# EAGLE design SmartON (EAGLE 9.4.2)
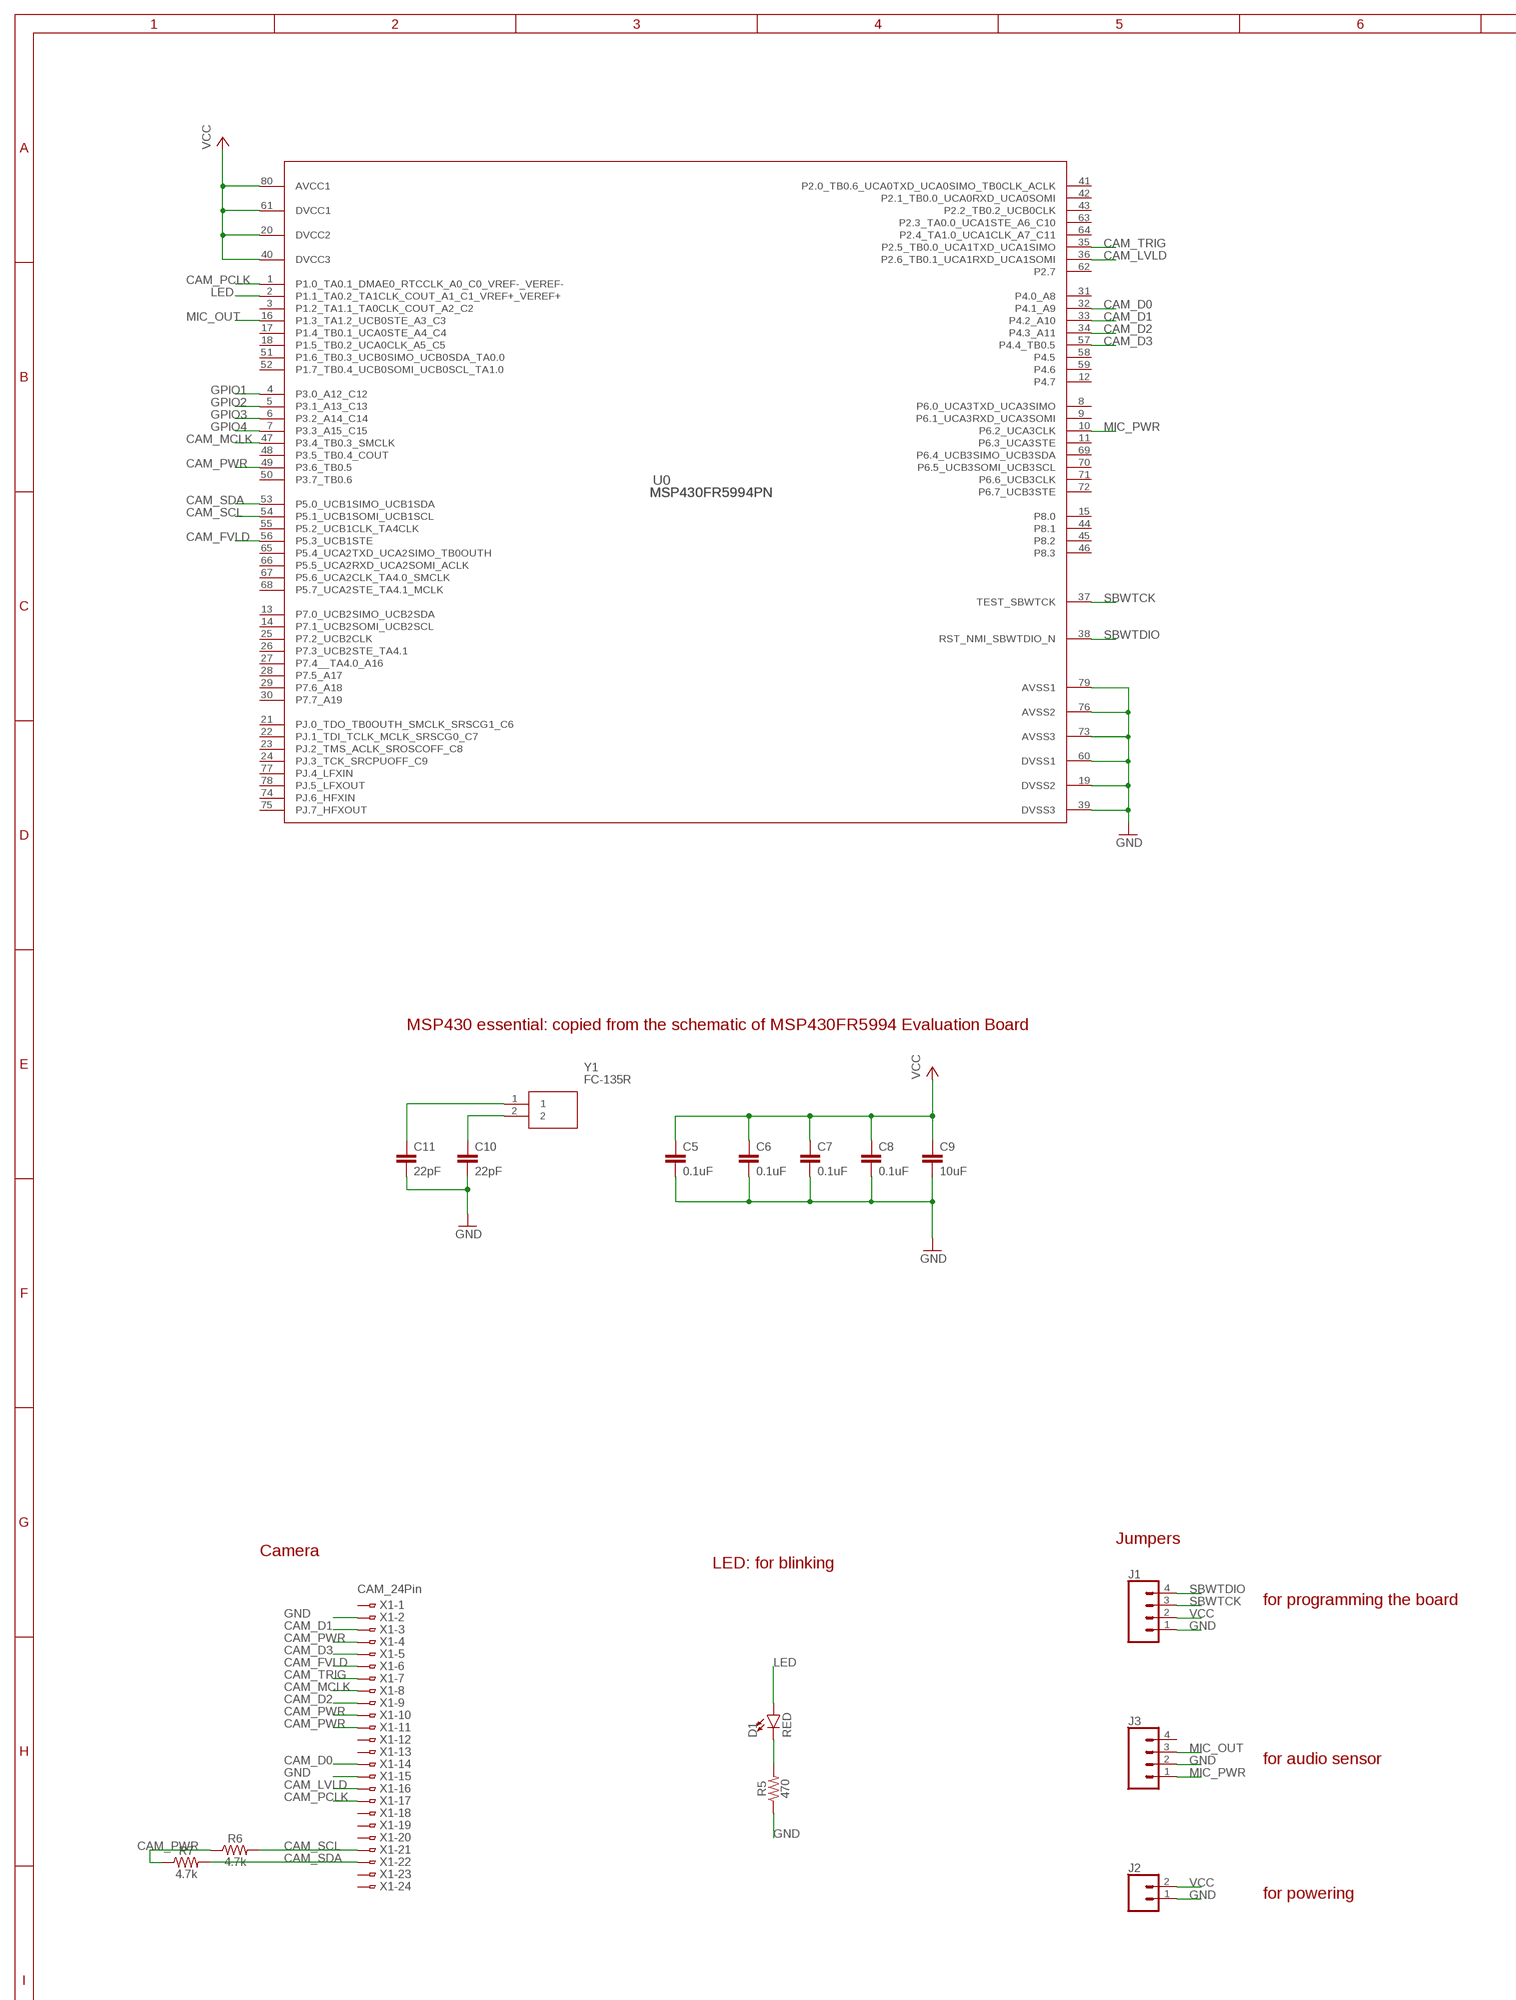
[diagram p0: schematic, sheet 1, part 1 of 2]
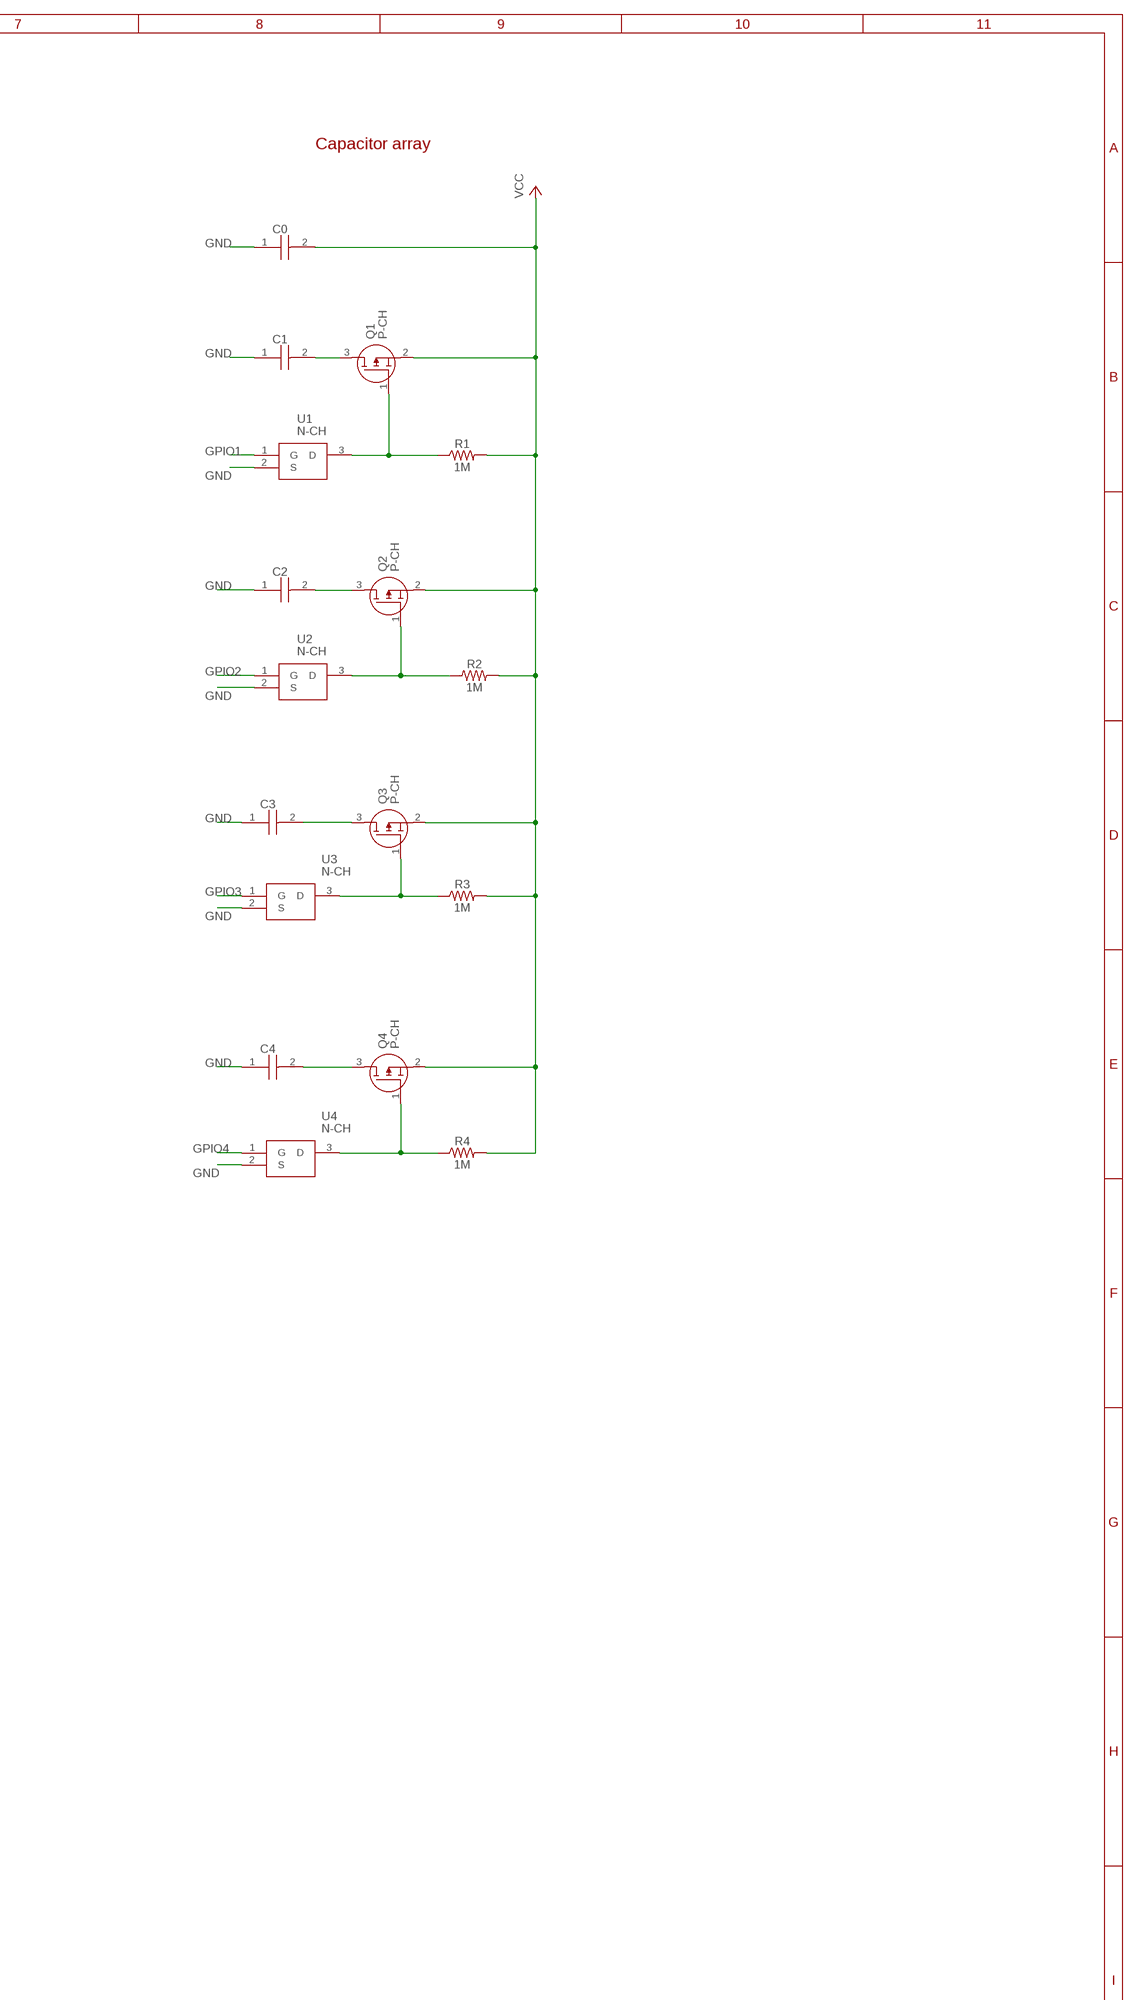
[diagram p1: schematic, sheet 1, part 2 of 2]

## Parts
C0  DBN-5R5D224T  [CAPPRD500W130D1350H800]
C1  DBN-5R5D224T  [CAPPRD500W130D1350H800]
C2  DBN-5R5D224T  [CAPPRD500W130D1350H800]
C3  DBN-5R5D224T  [CAPPRD500W130D1350H800]
C4  DBN-5R5D224T  [CAPPRD500W130D1350H800]
C5  0.1uF  0.1UF-0603-25V-5%  [0603]
C6  0.1uF  0.1UF-0603-25V-5%  [0603]
C7  0.1uF  0.1UF-0603-25V-5%  [0603]
C8  0.1uF  0.1UF-0603-25V-5%  [0603]
C9  10uF  10UF-0603-6.3V-20%  [0603]
C10  22pF  22PF-0603-50V-5%  [0603]
C11  22pF  22PF-0603-50V-5%  [0603]
D1  RED  LED-RED0603  [LED-0603]
J1  CONN_04LOCK  [1X04_LOCK]
J2  CONN_02  [1X02]
J3  CONN_04LOCK  [1X04_LOCK]
Q1  P-CH  IRLML5103PBF  [SOT95P237X112-3N]
Q2  P-CH  IRLML5103PBF  [SOT95P237X112-3N]
Q3  P-CH  IRLML5103PBF  [SOT95P237X112-3N]
Q4  P-CH  IRLML5103PBF  [SOT95P237X112-3N]
R1  1M  1MOHM-0603-1/4W-5%  [0603]
R2  1M  1MOHM-0603-1/4W-5%  [0603]
R3  1M  1MOHM-0603-1/4W-5%  [0603]
R4  1M  1MOHM-0603-1/4W-5%  [0603]
R5  470  470OHM-0603-1/10W-1%  [0603]
R6  4.7k  4.7KOHM-0603-1/10W-1%  [0603]
R7  4.7k  4.7KOHM-0603-1/10W-1%  [0603]
U0  MSP430FR5994PN  MSP430FR5994IPN  [PN0080A_N]
U1  N-CH  DMN2004K-7  [SOT95P240X110-3N]
U2  N-CH  DMN2004K-7  [SOT95P240X110-3N]
U3  N-CH  DMN2004K-7  [SOT95P240X110-3N]
U4  N-CH  DMN2004K-7  [SOT95P240X110-3N]
X1  CAM_24Pin  FH12-24S-0.5SH  [FH12-24S-0.5SH]
Y1  FC-135R  [FC135327680KAAG0]

## Nets
CAM_D0: U0.32(P4.1_A9) X1.14
CAM_D1: U0.33(P4.2_A10) X1.3
CAM_D2: U0.34(P4.3_A11) X1.9
CAM_D3: U0.57(P4.4_TB0.5) X1.5
CAM_FVLD: U0.56(P5.3_UCB1STE) X1.6
CAM_LVLD: U0.36(P2.6_TB0.1_UCA1RXD_UCA1SOMI) X1.16
CAM_MCLK: U0.47(P3.4_TB0.3_SMCLK) X1.8
CAM_PCLK: U0.1(P1.0_TA0.1_DMAE0_RTCCLK_A0_C0_VREF-_VEREF-) X1.17
CAM_PWR: R6.1 R7.1 U0.49(P3.6_TB0.5) X1.4 X1.10 X1.11
CAM_SCL: R6.2 U0.54(P5.1_UCB1SOMI_UCB1SCL) X1.21
CAM_SDA: R7.2 U0.53(P5.0_UCB1SIMO_UCB1SDA) X1.22
CAM_TRIG: U0.35(P2.5_TB0.0_UCA1TXD_UCA1SIMO) X1.7
GND: C0.1(+) C1.1(+) C2.1(+) C3.1(+) C4.1(+) C5.2 C6.2 C7.2 C8.2 C9.2 C10.2 C11.2 J1.1 J2.1 J3.2 R5.1 U0.19(DVSS2) U0.39(DVSS3) U0.60(DVSS1) U0.73(AVSS3) U0.76(AVSS2) U0.79(AVSS1) U1.2(S) U2.2(S) U3.2(S) U4.2(S) X1.2 X1.15
GPIO1: U0.4(P3.0_A12_C12) U1.1(G)
GPIO2: U0.5(P3.1_A13_C13) U2.1(G)
GPIO3: U0.6(P3.2_A14_C14) U3.1(G)
GPIO4: U0.7(P3.3_A15_C15) U4.1(G)
LED: D1.A U0.2(P1.1_TA0.2_TA1CLK_COUT_A1_C1_VREF+_VEREF+)
MIC_OUT: J3.3 U0.16(P1.3_TA1.2_UCB0STE_A3_C3)
MIC_PWR: J3.1 U0.10(P6.2_UCA3CLK)
N$1: C10.1 Y1.2
N$2: C11.1 Y1.1
N$3: Q1.1(G) R1.1 U1.3(D)
N$4: C1.2(-) Q1.3(D)
N$5: C2.2(-) Q2.3(D)
N$6: C3.2(-) Q3.3(D)
N$7: Q2.1(G) R2.1 U2.3(D)
N$8: Q3.1(G) R3.1 U3.3(D)
N$9: C4.2(-) Q4.3(D)
N$10: Q4.1(G) R4.1 U4.3(D)
N$11: D1.C R5.2
SBWTCK: J1.3 U0.37(TEST_SBWTCK)
SBWTDIO: J1.4 U0.38(RST_NMI_SBWTDIO_N)
VCC: C0.2(-) C5.1 C6.1 C7.1 C8.1 C9.1 J1.2 J2.2 Q1.2(S) Q2.2(S) Q3.2(S) Q4.2(S) R1.2 R2.2 R3.2 R4.2 U0.20(DVCC2) U0.40(DVCC3) U0.61(DVCC1) U0.80(AVCC1)
Unconnected: J3.4 U0.3(P1.2_TA1.1_TA0CLK_COUT_A2_C2) U0.8(P6.0_UCA3TXD_UCA3SIMO) U0.9(P6.1_UCA3RXD_UCA3SOMI) U0.11(P6.3_UCA3STE) U0.12(P4.7) U0.13(P7.0_UCB2SIMO_UCB2SDA) U0.14(P7.1_UCB2SOMI_UCB2SCL) U0.15(P8.0) U0.17(P1.4_TB0.1_UCA0STE_A4_C4) U0.18(P1.5_TB0.2_UCA0CLK_A5_C5) U0.21(PJ.0_TDO_TB0OUTH_SMCLK_SRSCG1_C6) U0.22(PJ.1_TDI_TCLK_MCLK_SRSCG0_C7) U0.23(PJ.2_TMS_ACLK_SROSCOFF_C8) U0.24(PJ.3_TCK_SRCPUOFF_C9) U0.25(P7.2_UCB2CLK) U0.26(P7.3_UCB2STE_TA4.1) U0.27(P7.4__TA4.0_A16) U0.28(P7.5_A17) U0.29(P7.6_A18) U0.30(P7.7_A19) U0.31(P4.0_A8) U0.41(P2.0_TB0.6_UCA0TXD_UCA0SIMO_TB0CLK_ACLK) U0.42(P2.1_TB0.0_UCA0RXD_UCA0SOMI) U0.43(P2.2_TB0.2_UCB0CLK) U0.44(P8.1) U0.45(P8.2) U0.46(P8.3) U0.48(P3.5_TB0.4_COUT) U0.50(P3.7_TB0.6) U0.51(P1.6_TB0.3_UCB0SIMO_UCB0SDA_TA0.0) U0.52(P1.7_TB0.4_UCB0SOMI_UCB0SCL_TA1.0) U0.55(P5.2_UCB1CLK_TA4CLK) U0.58(P4.5) U0.59(P4.6) U0.62(P2.7) U0.63(P2.3_TA0.0_UCA1STE_A6_C10) U0.64(P2.4_TA1.0_UCA1CLK_A7_C11) U0.65(P5.4_UCA2TXD_UCA2SIMO_TB0OUTH) U0.66(P5.5_UCA2RXD_UCA2SOMI_ACLK) U0.67(P5.6_UCA2CLK_TA4.0_SMCLK) U0.68(P5.7_UCA2STE_TA4.1_MCLK) U0.69(P6.4_UCB3SIMO_UCB3SDA) U0.70(P6.5_UCB3SOMI_UCB3SCL) U0.71(P6.6_UCB3CLK) U0.72(P6.7_UCB3STE) U0.74(PJ.6_HFXIN) U0.75(PJ.7_HFXOUT) U0.77(PJ.4_LFXIN) U0.78(PJ.5_LFXOUT) X1.1 X1.12 X1.13 X1.18 X1.19 X1.20 X1.23 X1.24

## Notes on the sheet
- Capacitor array
- MSP430 essential: copied from the schematic of MSP430FR5994 Evaluation Board
- Jumpers
- Camera
- LED: for blinking
- for programming the board
- for audio sensor
- for powering

## Library data of the parts
C0 C1-C4 = DBN-5R5D224T_capbank_small:DBN-5R5D224T: Supercapacitors / Ultracapacitors .22F 5.5V Low Resistance Source: Datasheet <https://componentsearchengine.com/Datasheets/1/DBN-5R5D224T.pdf>; DESCRIPTION: Supercapacitors / Ultracapacitors .22F 5.5V Low Resistance; HEIGHT: 8mm; MANUFACTURER_NAME: Elna; MANUFACTURER_PART_NUMBER: DBN-5R5D224T
C5-C8 = SparkFun-Capacitors:0.1UF: 0.1µF ceramic capacitors A capacitor is a passive two-terminal electrical component used to store electrical energy temporarily in an electric field.; PROD_ID: CAP-08604
C9 = SparkFun-Capacitors:10UF: 10.0µF ceramic capacitors A capacitor is a passive two-terminal electrical component used to store electrical energy temporarily in an electric field.; PROD_ID: CAP-11015
C10 C11 = SparkFun-Capacitors:22PF: 22pF ceramic capacitors A capacitor is a passive two-terminal electrical component used to store electrical energy temporarily in an electric field.; PROD_ID: CAP-07876
D1 = SparkFun-LED:LED-RED: Red SMD LED Used in manufacturing of most products at SparkFun Packages: 0603 - SMD 0603 package [Product Link] <http://docs.avagotech.com/docs/AV02-0551EN> 0603 SMART - SMD 0603 SMART package ( more efficient and expensive)[Product Link] <http://www.osram-os.com/Graphics/XPic2/00077099_0.pdf> 1206 - SMD1206 package [Product Link] <https://www.sparkfun.com/datasheets/DevTools/LilyPad/Q150OVS4.pdff> SparkFun Products: Pro Mini 328 -5V <https://www.sparkfun.com/products/821> RedBoard <https://www.sparkfun.com/products/12757> IOIO-OTG <https://www.sparkfun.com/products/13613>; PROD_ID: DIO-00819
J1 J3 = SparkFun-Connectors:CONN_04: Multi connection point. Often used as Generic Header-pin footprint for 0.1 inch spaced/style header connections On any of the 0.1 inch spaced packages, you can populate with these: Break Away Headers - Straight <https://www.sparkfun.com/products/116> (PRT-00116) Break Away Male Headers - Right Angle <https://www.sparkfun.com/products/553> (PRT-00553) Female Headers <https://www.sparkfun.com/products/115> (PRT-00115) Break Away Headers - Machine Pin <https://www.sparkfun.com/products/117> (PRT-00117) Break Away Female Headers - Swiss Machine Pin <https://www.sparkfun.com/products/743> (PRT-00743) For SCREWTERMINALS and SPRING TERMINALS visit here: Screw Terimnals on SparkFun.com <https://www.sparkfun.com/search/results?term=Screw+Terminals> (5mm/3.5mm/2.54mm spacing) This device is also useful as a general connection point to wire up your design to another part of your project. Our various solder wires solder well into these plated through hole pads. Hook-Up Wire - Assortment (Stranded, 22 AWG) <https://www.sparkfun.com/products/11375> (PRT-11375) Hook-Up Wire - Assortment (Solid Core, 22 AWG) <https://www.sparkfun.com/products/11367> (PRT-11367) View the entire wire category on our website here <https://www.sparkfun.com/categories/141> Special notes: Molex polarized connector foot print use with SKU : PRT-08231 with associated crimp pins and housings. 1MM SMD Version SKU: PRT-10208; PROD_ID: CONN-09696
J2 = SparkFun-Connectors:CONN_02: Multi connection point. Often used as Generic Header-pin footprint for 0.1 inch spaced/style header connections On any of the 0.1 inch spaced packages, you can populate with these: Break Away Headers - Straight <https://www.sparkfun.com/products/116> (PRT-00116) Break Away Male Headers - Right Angle <https://www.sparkfun.com/products/553> (PRT-00553) Female Headers <https://www.sparkfun.com/products/115> (PRT-00115) Break Away Headers - Machine Pin <https://www.sparkfun.com/products/117> (PRT-00117) Break Away Female Headers - Swiss Machine Pin <https://www.sparkfun.com/products/743> (PRT-00743) For SCREWTERMINALS and SPRING TERMINALS visit here: Screw Terimnals on SparkFun.com <https://www.sparkfun.com/search/results?term=Screw+Terminals> (5mm/3.5mm/2.54mm spacing) This device is also useful as a general connection point to wire up your design to another part of your project. Our various solder wires solder well into these plated through hole pads. Hook-Up Wire - Assortment (Stranded, 22 AWG) <https://www.sparkfun.com/products/11375> (PRT-11375) Hook-Up Wire - Assortment (Solid Core, 22 AWG) <https://www.sparkfun.com/products/11367> (PRT-11367) View the entire wire category on our website here <https://www.sparkfun.com/categories/141> Special notes: Molex polarized connector foot print use with: PRT-08233 with associated crimp pins and housings. 2.54_SCREWTERM for use with PRT-10571. 3.5mm Screw Terminal footprints for PRT-08084 5mm Screw Terminal footprints for use with PRT-08432
Q1-Q4 = IRLML5103PBF:IRLML5103PBF: INFINEON - IRLML5103PBF - MOSFET, P, -30V, -0.61A, MICRO 3 Source: Datasheet <https://componentsearchengine.com/Datasheets/2/IRLML5103PBF.pdf>; DESCRIPTION: INFINEON - IRLML5103PBF - MOSFET, P, -30V, -0.61A, MICRO 3; HEIGHT: 1.12mm; MANUFACTURER_NAME: Infineon; MANUFACTURER_PART_NUMBER: IRLML5103PBF
R1-R4 = SparkFun-Resistors:1MOHM: 1MΩ resistor A resistor is a passive two-terminal electrical component that implements electrical resistance as a circuit element. Resistors act to reduce current flow, and, at the same time, act to lower voltage levels within circuits. - Wikipedia; PROD_ID: RES-07868
R5 = SparkFun-Resistors:470OHM: 470Ω resistor A resistor is a passive two-terminal electrical component that implements electrical resistance as a circuit element. Resistors act to reduce current flow, and, at the same time, act to lower voltage levels within circuits. - Wikipedia; PROD_ID: RES-07869
R6 R7 = SparkFun-Resistors:4.7KOHM: 4.7kΩ resistor A resistor is a passive two-terminal electrical component that implements electrical resistance as a circuit element. Resistors act to reduce current flow, and, at the same time, act to lower voltage levels within circuits. - Wikipedia; PROD_ID: RES-07857
U0 = MSP430FR5994_MCU_80pin:MSP430FR5994IPN; MANUFACTURER: Texas Instruments; PARTNUMBER: MSP430FR5994IPNR; REFDES: RefDes; TYPE: TYPE; VALUE: Value
U1-U4 = DMN2004K-7:DMN2004K-7: N-CHANNEL ENHANCEMENT MODE FIELD EFFECT TRANSISTOR Source: Datasheet <http://componentsearchengine.com/Datasheets/1/DMN2004K-7.pdf>; ALLIED_NUMBER: 70438061; ALLIED_PRICE-STOCK: https://www.alliedelec.com/diodes-inc-dmn2004k-7/70438061/; DESCRIPTION: N-CHANNEL ENHANCEMENT MODE FIELD EFFECT TRANSISTOR; HEIGHT: mm; MANUFACTURER_NAME: Diodes Inc.; MANUFACTURER_PART_NUMBER: DMN2004K-7; MOUSER_PART_NUMBER: 621-DMN2004K-7; MOUSER_PRICE-STOCK: https://www.mouser.com/Search/Refine.aspx?Keyword=621-DMN2004K-7; RS_PART_NUMBER: 7082425P; RS_PRICE-STOCK: http://uk.rs-online.com/web/p/products/7082425P
X1 = con-hirose:FH12-24S-0.5S: 0.5mm Pitch Connectors For FPC/FFC Source: Data sheet <http://www.hirose.co.jp/cataloge_hp/e58605370.pdf>; MPN: FH12-24S-0.5SH(55); OC_FARNELL: 1324552; OC_NEWARK: 34M6170
Y1 = FC-135R:FC-135R: https://www.mouser.com/ds/2/137/1699449-465441.pdf Source: Datasheet <https://www.mouser.com/ds/2/137/1699449-465441.pdf>; ARROW_PART_NUMBER: FC-135R; DESCRIPTION: https://www.mouser.com/ds/2/137/1699449-465441.pdf; HEIGHT: mm; MANUFACTURER_NAME: SEIKO INSTRUMENTS; MANUFACTURER_PART_NUMBER: FC-135R

## Board
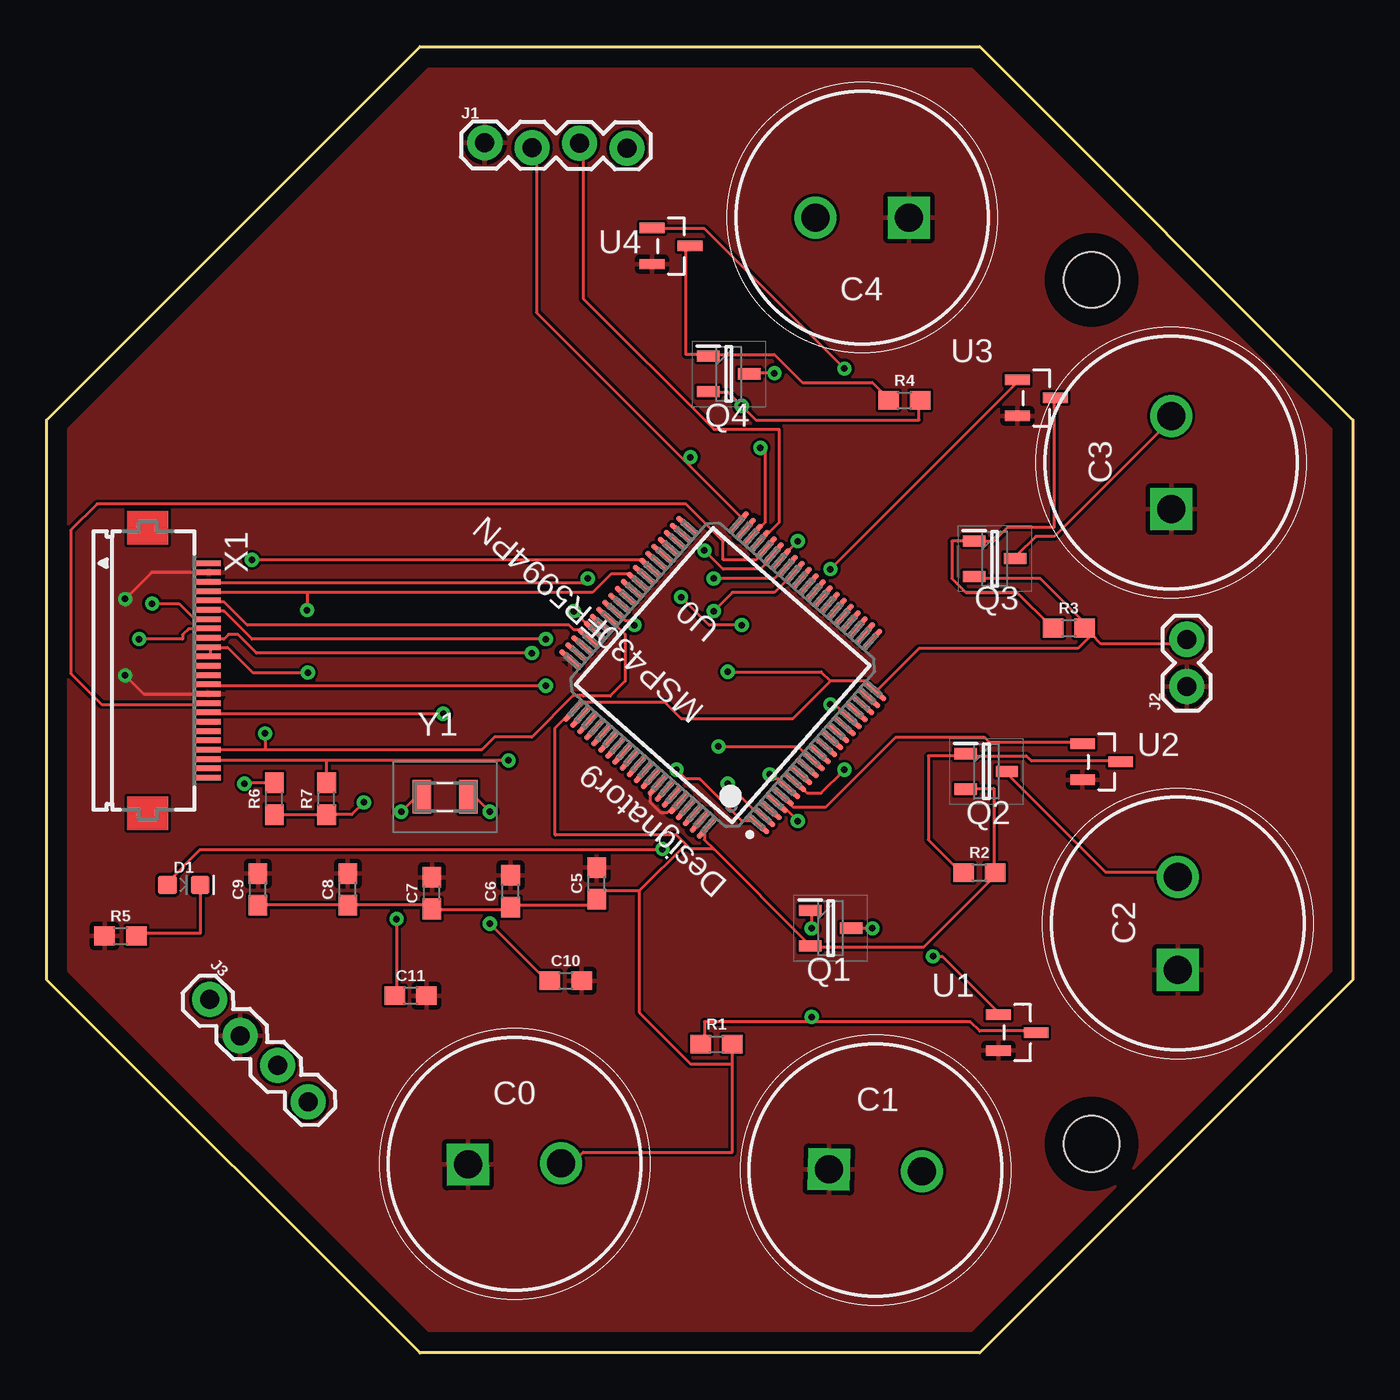
[diagram p2: board, top side]
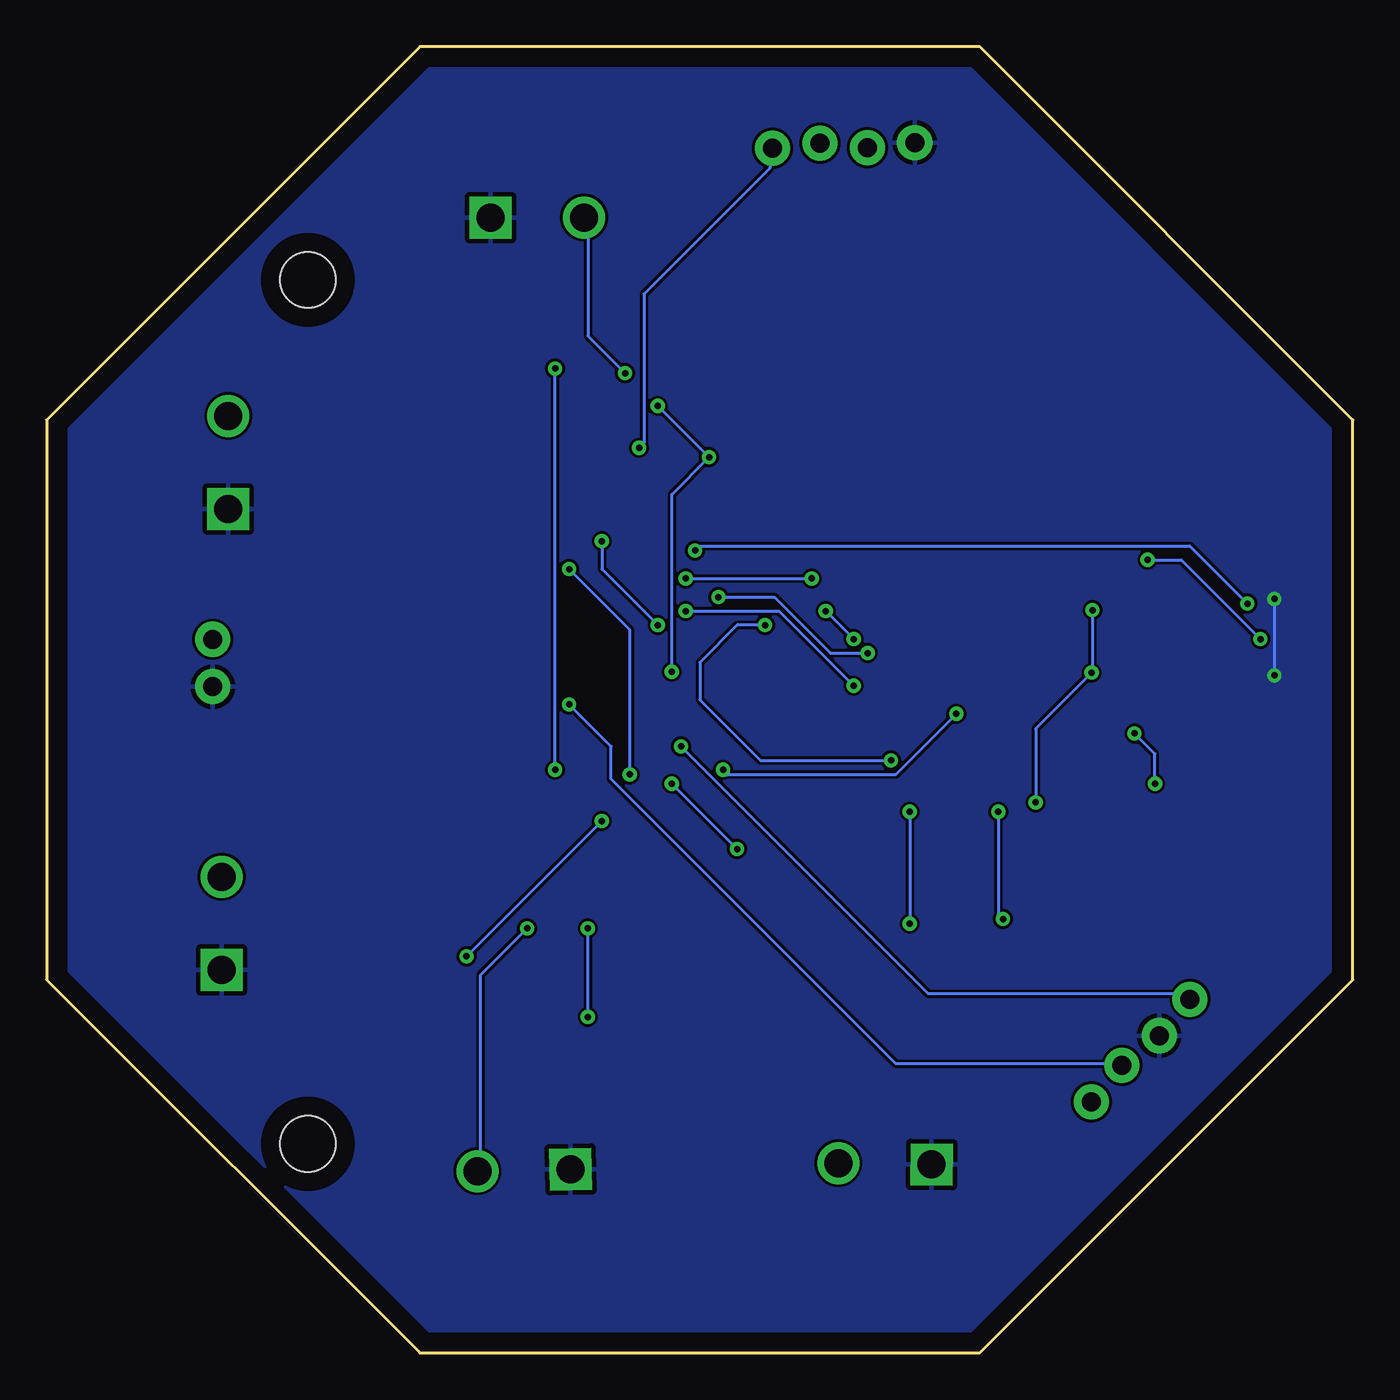
[diagram p3: board, bottom side, seen from below]

Size 70 x 70 mm. Coordinates in mm from the lower left corner, seen from the top.
Outline: 0,50 20,70 50,70 70,50 70,20 50,0 20,0 0,20 0,50
Copper layers (1*16): Top 0.035mm / dielectric 1.5mm / Bottom 0.035mm
Design rules "default": minimum track width 6mil, minimum drill 0.35mm, track to track 6mil, track to pad 6mil, pad to pad 6mil, via to via 6mil, smd to smd 6mil, copper to edge 40mil, drill to drill 6mil, minimum pad ring 10mil, minimum via ring 8mil, stop-mask expansion 4mil, vias tented up to drill 0mil, thermal gap 10mil
Holes 3 mm at 56,11.2 56,57.5

### Footprints (pad centres in the part's own frame; a part is rotated, then mirrored left to right if it is on the bottom)
CAPPRD500W130D1350H800 = drill 1.5 pad 2.25 square: 1 0,0 | drill 1.5 pad 2.25: 2 5,0
0603 = smd 1.1 x 1: 1 -0.85,0; 2 0.85,0
LED-0603 = smd 1 x 1: A -0.877,0; C 0.877,0
1X04_LOCK = drill 1.016 pad 1.88: 1 0,0.127; 2 2.54,-0.127; 3 5.08,0.127; 4 7.62,-0.127
1X02 = drill 1.016 pad 1.88: 1 0,0; 2 2.54,0
SOT95P237X112-3N = smd 1.2 x 0.6: 1 -1.1,0.95; 2 -1.1,-0.95; 3 1.1,0
PN0080A_N = smd 1.45 x 0.3: 1 -6.725,4.75; 2 -6.725,4.25; 3 -6.725,3.75; 4 -6.725,3.25; 5 -6.725,2.75; 6 -6.725,2.25; 7 -6.725,1.75; 8 -6.725,1.25; 9 -6.725,0.75; 10 -6.725,0.25; 11 -6.725,-0.25; 12 -6.725,-0.75; 13 -6.725,-1.25; 14 -6.725,-1.75; 15 -6.725,-2.25; 16 -6.725,-2.75; 17 -6.725,-3.25; 18 -6.725,-3.75; 19 -6.725,-4.25; 20 -6.725,-4.75; 41 6.725,-4.75; 42 6.725,-4.25; 43 6.725,-3.75; 44 6.725,-3.25; 45 6.725,-2.75; 46 6.725,-2.25; 47 6.725,-1.75; 48 6.725,-1.25; 49 6.725,-0.75; 50 6.725,-0.25; 51 6.725,0.25; 52 6.725,0.75; 53 6.725,1.25; 54 6.725,1.75; 55 6.725,2.25; 56 6.725,2.75; 57 6.725,3.25; 58 6.725,3.75; 59 6.725,4.25; 60 6.725,4.75 | smd 0.3 x 1.45: 21 -4.75,-6.725; 22 -4.25,-6.725; 23 -3.75,-6.725; 24 -3.25,-6.725; 25 -2.75,-6.725; 26 -2.25,-6.725; 27 -1.75,-6.725; 28 -1.25,-6.725; 29 -0.75,-6.725; 30 -0.25,-6.725; 31 0.25,-6.725; 32 0.75,-6.725; 33 1.25,-6.725; 34 1.75,-6.725; 35 2.25,-6.725; 36 2.75,-6.725; 37 3.25,-6.725; 38 3.75,-6.725; 39 4.25,-6.725; 40 4.75,-6.725; 61 4.75,6.725; 62 4.25,6.725; 63 3.75,6.725; 64 3.25,6.725; 65 2.75,6.725; 66 2.25,6.725; 67 1.75,6.725; 68 1.25,6.725; 69 0.75,6.725; 70 0.25,6.725; 71 -0.25,6.725; 72 -0.75,6.725; 73 -1.25,6.725; 74 -1.75,6.725; 75 -2.25,6.725; 76 -2.75,6.725; 77 -3.25,6.725; 78 -3.75,6.725; 79 -4.25,6.725; 80 -4.75,6.725
SOT95P240X110-3N = smd 1.321 x 0.559: 1 -1.016,0.965; 2 -1.016,-0.965; 3 1.016,0
FH12-24S-0.5SH = smd 0.3 x 1.3: 1 -5.75,3.25; 2 -5.25,3.25; 3 -4.75,3.25; 4 -4.25,3.25; 5 -3.75,3.25; 6 -3.25,3.25; 7 -2.75,3.25; 8 -2.25,3.25; 9 -1.75,3.25; 10 -1.25,3.25; 11 -0.75,3.25; 12 -0.25,3.25; 13 0.25,3.25; 14 0.75,3.25; 15 1.25,3.25; 16 1.75,3.25; 17 2.25,3.25; 18 2.75,3.25; 19 3.25,3.25; 20 3.75,3.25; 21 4.25,3.25; 22 4.75,3.25; 23 5.25,3.25; 24 5.75,3.25
FC135327680KAAG0 = smd 1 x 1.8: 1 -1.25,0; 2 1.25,0

### Placement (x,y rotation side)
C0  22.58,10.09 0.9 top
C1  41.92,9.84 358.8 top
C2  60.62,20.51 90 top
C3  60.26,45.21 90 top
C4  46.2,60.84 180 top
C5  29.48,25.16 90 top
C6  24.86,24.74 90 top
C7  20.65,24.64 90 top
C8  16.14,24.84 90 top
C9  11.33,24.84 90 top
C10  27.82,19.94 0 top
C11  19.51,19.14 0 top
D1  7.35,25.07 0 top
J1  23.48,64.73 359.7 top
J2  61.1,35.7 90 top
J3  8.64,18.86 315.8 top
Q1  42.01,22.76 0 top
Q2  50.36,31.16 0 top
Q3  50.81,42.56 0 top
Q4  36.56,52.46 0 top
R1  35.9,16.54 0 top
R2  49.99,25.74 0 top
R3  54.78,38.84 0 top
R4  45.97,51.04 0 top
R5  3.96,22.34 0 top
R6  12.2,29.7 90 top
R7  15,29.7 90 top
U0  36.23,36.32 138.7 top
U1  52.02,17.17 0 top
U2  56.53,31.67 0 top
U3  53.04,51.17 0 top
U4  33.46,59.31 0 top
X1  5.42,36.57 270 top
Y1  21.35,29.8 0 top

### Tracks (layer width: path | path; a pad name or v marks a point on that pad's centre or on a via)
CAM_D0  (via drill 0.35)
  Top 0.152: v26.75,35.75 8.75,35.75 X1.14 | v35.75,39.75 36.75,40.75 39,40.75 40,41.75 U0.32
  Bottom 0.152: v26.75,35.75 30.75,39.75 v35.75,39.75
CAM_D1  (via drill 0.35)
  Top 0.152: v29,41.5 28.75,41.25 8.75,41.25 X1.3 | v35.75,41.5 39,41.5 39.5,42 U0.33
  Bottom 0.152: v35.75,41.5 v29,41.5
CAM_D2  (via drill 0.35)
  Top 0.152: v26,37.5 11.25,37.5 10.25,38.5 9.75,38.5 9.5,38.25 8.75,38.25 X1.9 | v34,40.5 35.5,39 v37.25,39 | v40.25,43.5 39.5,42.75 U0.34
  Bottom 0.152: v26,37.5 28,37.5 31,40.5 v34,40.5 | v37.25,39 40.25,42 v40.25,43.5
CAM_D3
  Top 0.152: X1.5 8.75,40.25 9.5,40.25 10.75,39 28,39 28.25,38.75 28.5,38.75 28.75,38.5 29,38.5 U0.57
CAM_FVLD  (via drill 0.35)
  Top 0.152: v26.75,38.25 11,38.25 9.5,39.75 8.75,39.75 X1.6 | v28.25,39.75 29.25,38.75 U0.56
  Bottom 0.152: v28.25,39.75 v26.75,38.25
CAM_LVLD
  Top 0.152: X1.16 8.5,34.75 2.95,34.75 1.3,36.4 1.3,44.1 2.7,45.5 34.25,45.5 36.25,43.5 36.25,42.5 38,42.5 38.5,43 U0.36
CAM_MCLK  (via drill 0.35)
  Top 0.152: v4.95,38.25 7.29,38.25 7.29,38.49 7.6,38.8 8.65,38.8 X1.8 | v11,42.5 32,42.5 32.25,42.25 U0.47
  Bottom 0.152: v11,42.5 9.2,42.5 v4.95,38.25
CAM_PCLK  (via drill 0.35)
  Top 0.152: v21.25,34.25 8.75,34.25 X1.17 | v33.75,31.25 34.25,30.75 35,30.75 37.25,28.5 38,28.5 U0.1
  Bottom 0.152: v21.25,34.25 24.5,31 33.75,31 v33.75,31.25
CAM_PWR  (via drill 0.35)
  Top 0.152: X1.11 8.75,37.25 8.75,37.75 X1.10 8.69,37.8 9.7,37.8 11.05,36.45 v14,36.45 | 13.95,40.75 29.25,40.75 30.25,41.75 31.25,41.75 31.5,41.5 U0.49 | 13.95,40.75 8.75,40.75 X1.4 | 13.95,40.75 v13.95,39.8 | v17,29.5 16.35,28.85 R7.1 R6.1
  Bottom 0.152: v13.95,39.8 13.95,36.5 v14,36.45 17,33.45 v17,29.5
CAM_SCL  (via drill 0.35)
  Top 0.152: U0.54 30.25,39.25 31,38.5 31,36 30.2,35.2 28.76,35.2 28.74,35.22 28.22,35.22 26,33 24,33 23.32,32.32 11.7,32.32 | 11.7,32.32 X1.21 | R6.2 10.65,30.55 v10.6,30.5 | v11.7,33.2 11.7,32.32
  Bottom 0.152: v10.6,30.5 10.6,32.1 v11.7,33.2
CAM_SDA  (via drill 0.35)
  Top 0.152: v24.75,31.75 15,31.75 | 15,31.75 8.75,31.75 X1.22 | v31.5,39 31.25,39.25 31,39.25 30.5,39.75 U0.53 | R7.2 15,31.75
  Bottom 0.152: v31.5,39 33,39 35,37 35,35 31.75,31.75 v24.75,31.75
CAM_TRIG  (via drill 0.35)
  Top 0.152: v5.65,40.15 7.1,40.15 8,39.25 8.5,39.25 X1.7 | v35.25,43 36.25,42 38.25,42 39,42.75 U0.35
  Bottom 0.152: v5.65,40.15 8.75,43.25 35.25,43.25 v35.25,43
GND  (via drill 0.35)
  Top 0.152: X1.2 5.63,41.82 v4.21,40.4 | v4.21,36.3 5.19,35.32 X1.15 | U0.76 33.72,29.45 33.71,29.44 33.71,29.41 33.26,28.96 32.9,28.96 32.34,29.52 32.34,29.88 32.73,30.27 U0.73
  Bottom 0.152: v4.21,40.4 v4.21,36.3
  pour Top: 0,70 70,70 70,0 0,0
  pour Bottom: -0.2,70.2 70.2,70.2 70.2,-0.2 -0.2,-0.2
GPIO1  (via drill 0.35)
  Top 0.152: v47.5,21.25 48,21.25 51,18.25 U1.1 | v40.25,28.5 39.5,29.25 39.25,29.25 U0.4
  Bottom 0.152: v40.25,28.5 v47.5,21.25
GPIO2
  Top 0.152: U2.1 55.5,32.75 50.5,32.75 50.25,33 45.5,33 41.75,29.25 40,29.25 39.5,29.75 U0.5
GPIO3  (via drill 0.35)
  Top 0.152: v42,42 52,52 U3.1 | v38.75,31 39,30.75 39.25,30.75 39.75,30.25 U0.6
  Bottom 0.152: v42,42 38.75,38.75 v38.75,31
GPIO4  (via drill 0.35)
  Top 0.152: v42.75,52.75 35.25,60.25 32.5,60.25 U4.1 | v42.75,31.25 41.5,30 40.75,30 40.25,30.5 U0.7
  Bottom 0.152: v42.75,31.25 v42.75,52.75
LED  (via drill 0.35)
  Top 0.152: v33,27 32.95,26.95 8.2,26.95 6.5,25.25 D1.A | v36.5,30.5 38.25,28.75 U0.2
  Bottom 0.152: v36.5,30.5 v33,27
MIC_OUT  (via drill 0.35)
  Top 0.152: v42,34.75 42.25,34.75 43,34 U0.16
  Bottom 0.152: v42,34.75 39.75,32.5 39.75,30.75 24.5,15.5 12.5,15.5 J3.3
MIC_PWR  (via drill 0.35)
  Top 0.152: v36,32.5 40.25,32.5 41,31.75 U0.10
  Bottom 0.152: v36,32.5 22.75,19.25 8.75,19.25 8.75,19 J3.1
N$1  (via drill 0.35)
  Top 0.152: v23.75,23 26.75,20 C10.1 | v23.75,29 23,29.75 22.75,29.75 Y1.2
  Bottom 0.152: v23.75,29 v23.75,23
N$2  (via drill 0.35)
  Top 0.152: v18.75,23.25 18.75,19.25 C11.1 | v19,29 19.75,29.75 20,29.75 Y1.1
  Bottom 0.152: v18.75,23.25 19,23.5 v19,29
N$3  (via drill 0.35)
  Top 0.152: 41,17.75 49.5,17.75 50,17.25 53,17.25 U1.3 | 41,17.75 35.25,17.75 35.25,16.75 R1.1 | v41,22.75 41,23.5 Q1.1 | 41,17.75 v41,18
  Bottom 0.152: v41,18 v41,22.75
N$4  (via drill 0.35)
  Top 0.152: v44.25,22.75 43.25,22.75 Q1.3
  Bottom 0.152: v44.25,22.75 46.75,20.25 46.75,9.75 C1.2
N$5
  Top 0.152: Q2.3 51.5,31 56.75,25.75 60.5,25.75 C2.2
N$6
  Top 0.152: Q3.3 52,42.75 53,43.75 54,43.75 60.25,50 C3.2
N$7
  Top 0.152: R2.1 49,25.75 47.25,27.5 47.25,32 49.25,32 Q2.1 49.5,32 52.5,32 52.75,31.75 57.5,31.75 U2.3
N$8
  Top 0.152: R3.1 53.75,39 52,40.75 49.25,40.75 48.5,41.5 48.5,43.5 49.5,43.5 Q3.1 49.75,43.5 50.75,43.5 51.5,44.25 54,44.25 54,51 U3.3
N$9  (via drill 0.35)
  Top 0.152: v39,52.5 37.75,52.5 Q4.3
  Bottom 0.152: v39,52.5 41,54.5 41,60.75 C4.2
N$10
  Top 0.152: R4.1 45,51.25 44.25,52 40.5,52 39,53.5 35.5,53.5 Q4.1 35.25,53.5 34.25,53.5 34.25,59.25 U4.3
N$11
  Top 0.152: D1.C 8.25,25 8.25,22.5 5,22.5 R5.2
SBWTCK
  Top 0.152: U0.37 38.25,43.5 39.25,44.5 39.25,49.5 35.75,49.5 28.75,56.5 28.75,64.75 J1.3
SBWTDIO  (via drill 0.35)
  Top 0.152: v38.25,48.5 38.5,48.5 38.5,44.5 38,44 U0.38
  Bottom 0.152: v38.25,48.5 38,48.75 38,56.75 31.25,63.5 31.25,64.5 J1.4
VCC  (via drill 0.35)
  Top 0.152: R4.2 46.75,51 46.75,50 38,50 v37.25,50.75 36.5,51.5 35.5,51.5 Q4.2 | 34.25,47.75 26.25,55.75 26.25,64.5 J1.2 | 34.25,47.75 37.25,44.75 U0.40 | 34.25,47.75 v34.5,48 | 56,38.5 56.5,38 61,38 J2.2 | 56,38.5 55.75,38.75 R3.2 | Q3.2 49.75,41.5 53.25,41.5 55.75,39 R3.2 | 56,38.5 55.25,37.75 46.75,37.75 44.5,35.5 U0.20 43.87,36 42,36 | 56,38.5 R3.2 | 36.75,15.5 36.75,10.75 28.75,10.75 28.25,10.25 27.75,10.25 C0.2 | 36.75,15.5 R1.2 | C9.1 11.5,24 16,24 C8.1 16.25,24 20.5,24 C7.1 20.75,23.75 24.75,23.75 C6.1 25,24 29,24 29.25,24.25 C5.1 29.5,24.5 29.75,24.75 31.75,24.75 | Q2.2 49.5,30.25 50.75,30.25 50.75,25.75 R2.2 50.75,25.5 47,21.75 41,21.75 Q1.2 40.75,22 35.75,27 | 35.75,27 35.25,27.5 35.25,28 U0.80 | 34.25,27.25 34.5,27 35.75,27 | 34.25,27.25 33.75,27.75 27.25,27.75 27.25,33.5 28,34.25 U0.61 28.33,34.4 28.82,34.89 33.11,34.89 34,34 40,34 42,36 | 34.25,27.25 31.75,24.75 | 36.75,15.5 34.5,15.5 31.75,18.25 31.75,24.75 | v36.5,36.5 41.5,36.5 42,36
  Bottom 0.152: v37.25,50.75 v34.5,48 36.5,46 v36.5,36.5

### Text on the board
tText: GND | VCC | CK | DIO | GND | 09/2020 | UNC EI Lab | GND | VCC | GND | GND | PWR | GND | OUT | GND | GND